# EAGLE design Tiny 5 Circle SMD -v3 (EAGLE 6.2)
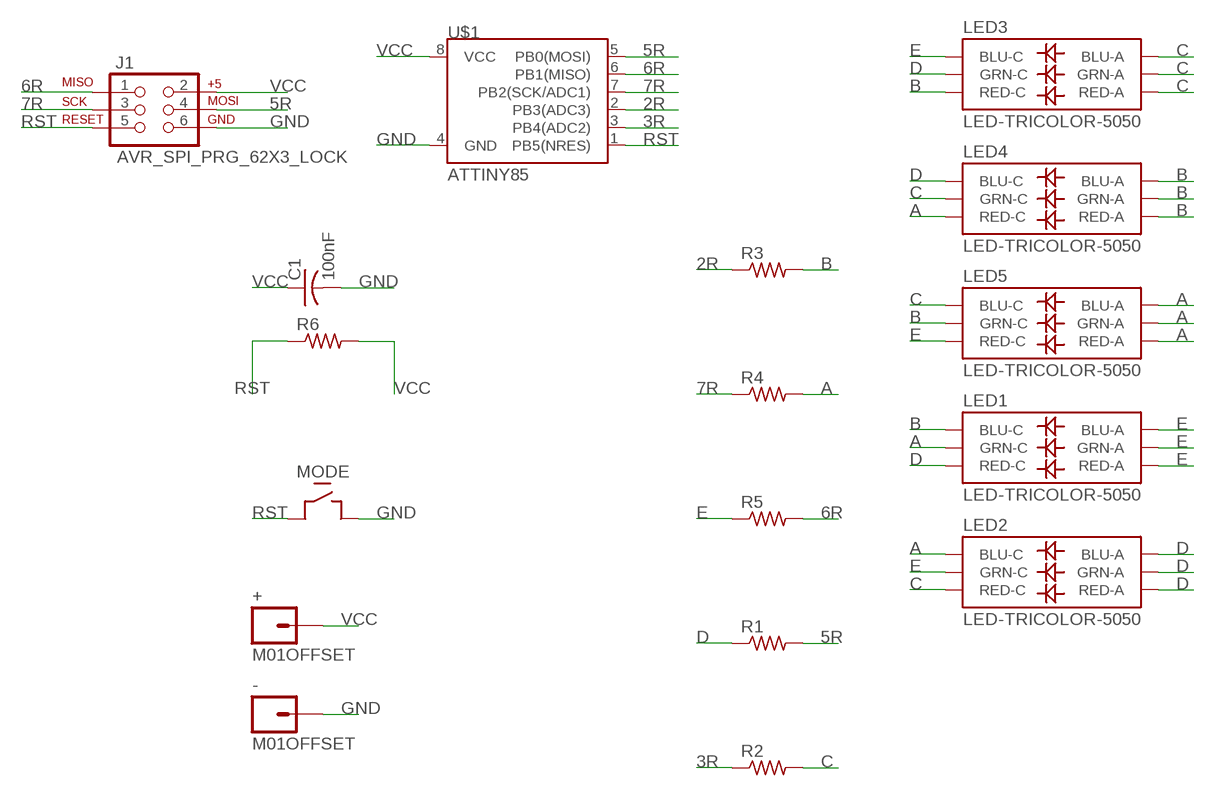
[diagram p0: schematic, sheet 1]

## Parts
+  M01OFFSET  [1X01_OFFSET]
-  M01OFFSET  [1X01_OFFSET]
C1  100nF  C-US025-025X050  [C025-025X050]
J1  AVR_SPI_PRG_62X3_LOCK  [2X3_LOCK]
LED1  LED-TRICOLOR-5050  [LED-TRICOLOR-5050]
LED2  LED-TRICOLOR-5050  [LED-TRICOLOR-5050]
LED3  LED-TRICOLOR-5050  [LED-TRICOLOR-5050]
LED4  LED-TRICOLOR-5050  [LED-TRICOLOR-5050]
LED5  LED-TRICOLOR-5050  [LED-TRICOLOR-5050]
MODE  3X6MM_SWITCH  [6X3MM-TACT]
R1  R-US_M0805  [M0805]
R2  R-US_M0805  [M0805]
R3  R-US_M0805  [M0805]
R4  R-US_M0805  [M0805]
R5  R-US_M0805  [M0805]
R6  R-US_M0805  [M0805]
U$1  ATTINY85  ATTINY45  [SO08-EIAJ]

## Nets
2R: R3.1 U$1.2(PB3(ADC3))
3R: R2.1 U$1.3(PB4(ADC2))
5R: J1.4 R1.2 U$1.5(PB0(MOSI))
6R: J1.1 R5.2 U$1.6(PB1(MISO))
7R: J1.3 R4.1 U$1.7(PB2(SCK/ADC1))
A: LED1.4(GRN-C) LED2.6(BLU-C) LED4.5(RED-C) LED5.1(BLU-A) LED5.2(RED-A) LED5.3(GRN-A) R4.2
B: LED1.6(BLU-C) LED3.5(RED-C) LED4.1(BLU-A) LED4.2(RED-A) LED4.3(GRN-A) LED5.4(GRN-C) R3.2
C: LED2.5(RED-C) LED3.1(BLU-A) LED3.2(RED-A) LED3.3(GRN-A) LED4.4(GRN-C) LED5.6(BLU-C) R2.2
D: LED1.5(RED-C) LED2.1(BLU-A) LED2.2(RED-A) LED2.3(GRN-A) LED3.4(GRN-C) LED4.6(BLU-C) R1.1
E: LED1.1(BLU-A) LED1.2(RED-A) LED1.3(GRN-A) LED2.4(GRN-C) LED3.6(BLU-C) LED5.5(RED-C) R5.1
GND: -.1 C1.2 J1.6 MODE.P$2(OUT) U$1.4(GND)
RST: J1.5 MODE.P$1(IN) R6.1 U$1.1(PB5(NRES))
VCC: +.1 C1.1 J1.2 R6.2 U$1.8(VCC)

## Library data of the parts
+ - = SparkFun:M01: Header 1 Standard 1-pin 0.1" header. Use with straight break away headers (SKU : PRT-00116), right angle break away headers (PRT-00553), swiss pins (PRT-00743), machine pins (PRT-00117), and female headers (PRT-00115).
C1 = adafruit:C-US: CAPACITOR, American symbol
J1 = SparkFun-Connectors:AVR_SPI_PRG_6: AVR ISP 6 Pin This is the reduced ISP connector for AVR programming. Common on Arduino. This footprint will take up less PCB space and can be used with a 10-pin to 6-pin adapter such as SKU: BOB-08508
LED1-LED5 = SparkFun:LED-TRICOLOR-5050
MODE = 00_PERSONAL:3X6MM_SWITCH
R1-R6 = adafruit:R-US_: RESISTOR, American symbol
U$1 = SparkFun:ATTINY45: Atmel ATTiny45

## Board
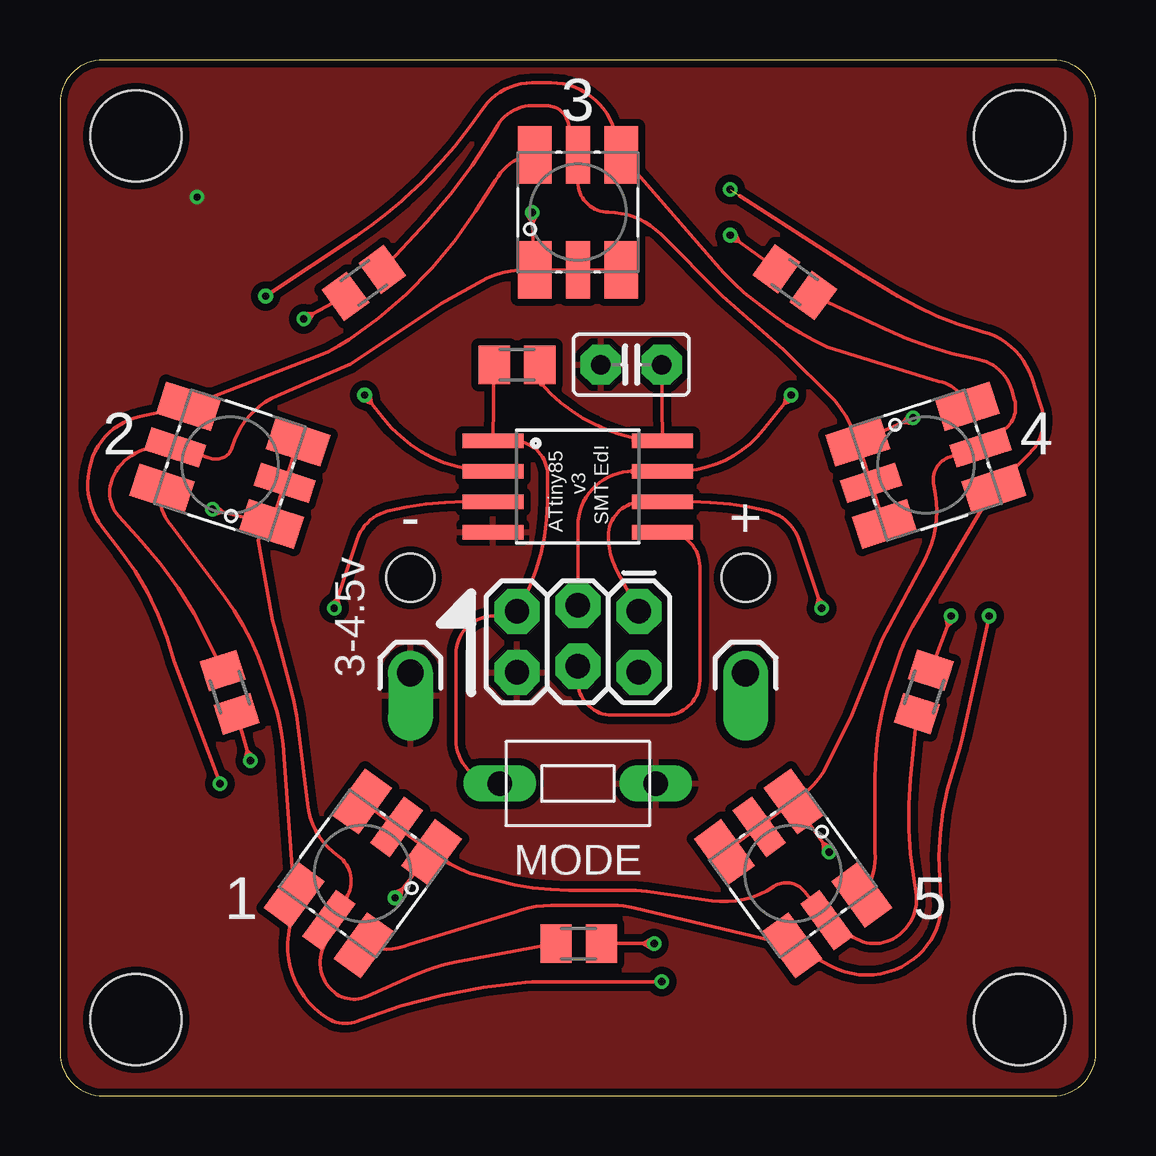
[diagram p1: board, top side]
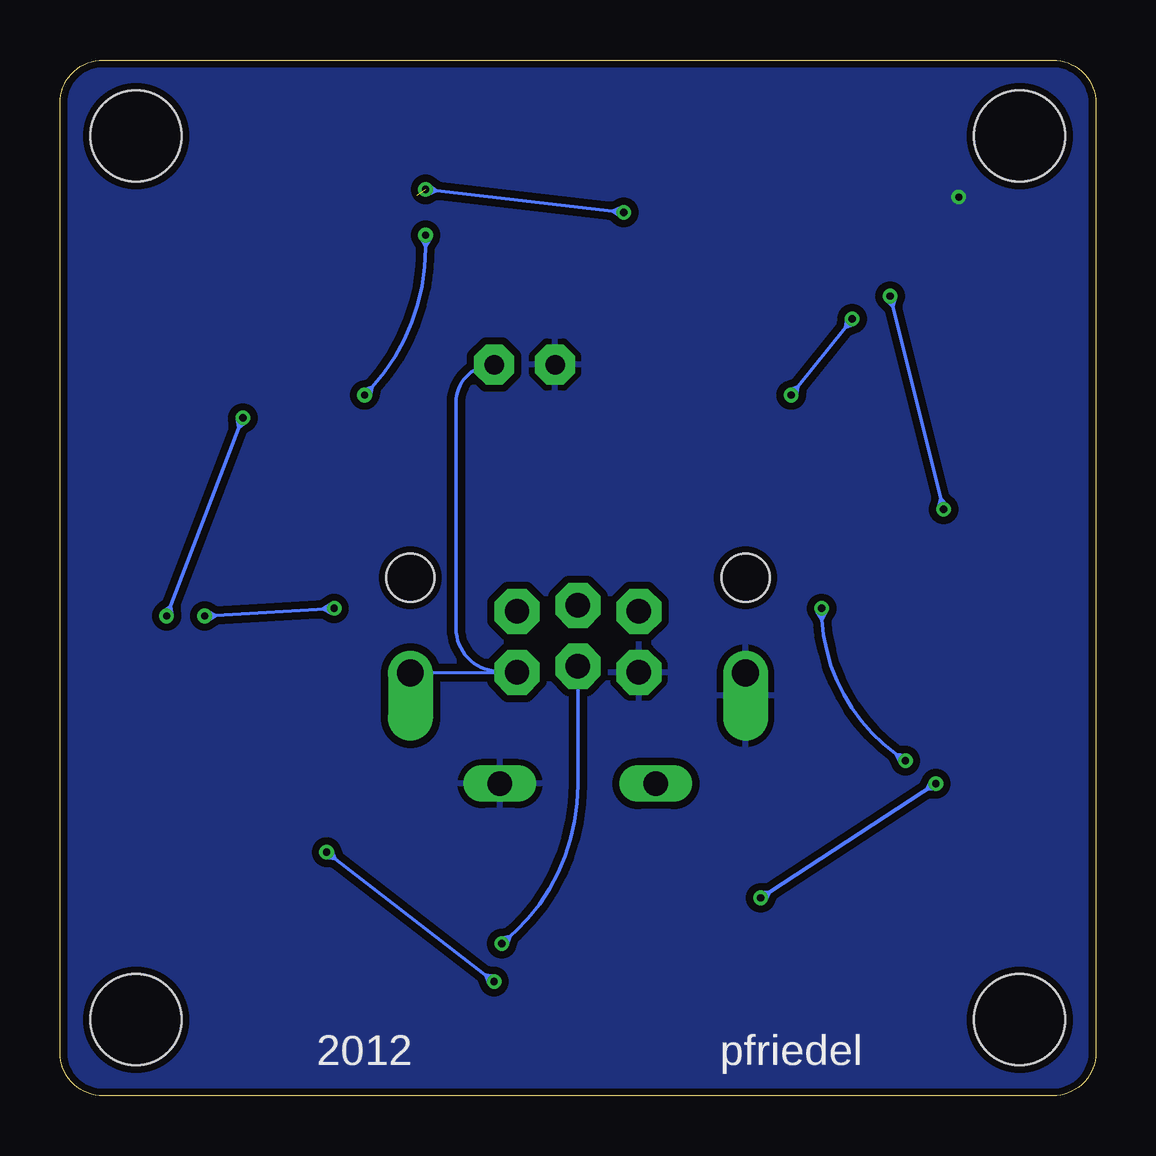
[diagram p2: board, bottom side, seen from below]

Size 43.18 x 43.18 mm. Coordinates in mm from the lower left corner, seen from the top.
Outline: 0,41.38 0,1.8 arc90 1.8,0 41.38,0 arc90 43.18,1.8 43.18,41.38 arc90 41.38,43.18 1.8,43.18 arc90 0,41.38
Copper layers (1*16): Top 0.035mm / dielectric 1.5mm / Bottom 0.035mm
Design rules: minimum track width 6mil, minimum drill 12mil, track to track 6mil, track to pad 6mil, pad to pad 6mil, via to via 6mil, smd to smd 0mil, copper to edge 10mil, drill to drill 10mil, minimum pad ring 10mil, minimum via ring 6mil, stop-mask expansion 2mil, vias tented up to drill 100mil, thermal gap 10mil
Holes 2 mm at 14.61,21.59 28.57,21.59
Holes 3.8 mm at 3.17,40.01 40.01,40.01 3.17,3.17 40.01,3.17

### Footprints (pad centres in the part's own frame; a part is rotated, then mirrored left to right if it is on the bottom)
1X01_OFFSET = drill 1.118 pad 1.88 offset: 1 0,0
C025-025X050 = drill 0.813 pad 1.676 octagon: 1 -1.27,0; 2 1.27,0
2X3_LOCK = drill 1.016 pad 1.88 octagon: 1 0,0; 2 0,2.54; 3 2.54,-0.254; 4 2.54,2.286; 5 5.08,0; 6 5.08,2.54
LED-TRICOLOR-5050 = smd 2.4 x 1.4: 1 -2.4,1.8; 3 -2.4,-1.8; 4 2.4,-1.8; 6 2.4,1.8 | smd 2.4 x 1: 2 -2.4,0; 5 2.4,0
6X3MM-TACT = drill 1.016 long: P$1 -3.251,0; P$2 3.251,0
M0805 = smd 1.3 x 1.6: 1 -0.95,0; 2 0.95,0
SO08-EIAJ = smd 0.61 x 2.54: 1 -1.905,-3.543; 2 -0.635,-3.543; 3 0.635,-3.543; 4 1.905,-3.543; 5 1.905,3.518; 6 0.635,3.518; 7 -0.635,3.518; 8 -1.905,3.518

### Placement (x,y rotation side)
+  28.57,17.62 180 top
-  14.61,17.62 180 top
C1  23.81,30.48 180 top
J1  24.13,20.19 180 top
LED1  12.62,9.27 234 top
LED2  7.09,26.29 162 top
LED3  21.59,36.83 90 top
LED4  36.09,26.29 18 top
LED5  30.56,9.27 306 top
MODE  21.59,13.02 0 top
R1  21.62,6.35 0 top
R2  7.08,16.82 108 top
R3  12.67,33.89 36 top
R4  30.63,33.92 324 top
R5  36.01,16.84 72 top
R6  19.05,30.48 0 top
U$1  21.59,25.4 270 top

### Tracks (layer width: path | path; a pad name or v marks a point on that pad's centre or on a via)
2R  (via drill 0.3)
  Top 0.152: U$1.2 arc-51 13.49,28.23 12.99,28.85 | 12.99,28.85 | 12.99,28.85 v12.7,29.21 | v10.16,32.38 10.56,32.6 | 10.56,32.6 R3.1 | 12.99,28.85 12.93,29.24 | 12.99,28.85 | 12.99,28.85 12.62,29 | v12.7,29.21 12.62,29 | 12.99,28.85 12.93,29.24 | 12.93,29.24 | v12.7,29.21 12.93,29.24 | 12.99,28.85 12.62,29 | 12.99,28.85 12.93,29.24 | v12.7,29.21 12.93,29.24 | 12.99,28.85 12.62,29 | v12.7,29.21 12.62,29 | 10.56,32.6 | 10.56,32.6 10.17,32.61 | 10.56,32.6 10.17,32.61 | v10.16,32.38 10.17,32.61 | 10.56,32.6 10.36,32.27 | v10.16,32.38 10.36,32.27 | 10.56,32.6 10.17,32.61 | v10.16,32.38 10.17,32.61 | 10.56,32.6 10.36,32.27 | v10.16,32.38 10.36,32.27
  Bottom 0.152: v12.7,29.21 12.41,29.57 | 12.41,29.57 | 12.41,29.57 10.45,32.03 | 10.45,32.03 | 10.45,32.03 v10.16,32.38 | 12.41,29.57 | 12.41,29.57 12.78,29.42 | v12.7,29.21 12.78,29.42 | 12.41,29.57 12.47,29.18 | 12.47,29.18 | v12.7,29.21 12.47,29.18 | 12.41,29.57 | 12.41,29.57 12.47,29.18 | v12.7,29.21 12.47,29.18 | 12.41,29.57 12.78,29.42 | v12.7,29.21 12.78,29.42 | 10.45,32.03 10.39,32.42 | 10.45,32.03 | 10.45,32.03 10.08,32.17 | v10.16,32.38 10.08,32.17 | 10.45,32.03 10.39,32.42 | 10.39,32.42 | v10.16,32.38 10.39,32.42 | 10.45,32.03 10.08,32.17 | 10.45,32.03 10.39,32.42 | v10.16,32.38 10.39,32.42 | 10.45,32.03 10.08,32.17 | v10.16,32.38 10.08,32.17
3R  (via drill 0.3)
  Top 0.152: U$1.3 16.87,24.77 arc14 13.66,24.37 arc58 12.39,23.2 v11.43,20.32 | v7.94,13.97 7.81,14.41 | 7.81,14.41 R2.1 | 11.57,20.75 11.28,20.49 | v11.43,20.32 11.28,20.49 | 11.57,20.75 11.65,20.37 | 11.65,20.37 | 11.57,20.75 11.28,20.49 | v11.43,20.32 11.28,20.49 | 11.57,20.75 11.65,20.37 | v11.43,20.32 11.65,20.37 | 7.81,14.41 7.71,14.02 v7.94,13.97 | 7.81,14.41 8.1,14.13 v7.94,13.97
  Bottom 0.152: v11.43,20.32 arc-4 11.42,19.86 | 11.42,19.86 arc-50 8.35,14.27 8.31,14.24 | 8.31,14.24 v7.94,13.97 | 11.42,19.86 | 11.42,19.86 11.62,20.2 | 11.62,20.2 | 11.42,19.86 11.23,20.21 | 8.31,14.24 7.91,14.2 | 7.91,14.2 | 11.42,19.86 | 11.42,19.86 11.62,20.2 | v11.43,20.32 11.62,20.2 | 11.42,19.86 11.23,20.21 | v11.43,20.32 11.23,20.21 | 11.42,19.86 11.62,20.2 | 11.62,20.2 | v11.43,20.32 11.62,20.2 | 11.42,19.86 11.23,20.21 | v11.43,20.32 11.23,20.21 | 11.42,19.86 11.62,20.2 | v11.43,20.32 11.62,20.2 | 11.42,19.86 11.23,20.21 | v11.43,20.32 11.23,20.21 | 8.31,14.24 7.91,14.2 | v7.94,13.97 7.91,14.2 | 8.31,14.24 8.15,13.88 v7.94,13.97
5R  (via drill 0.3)
  Top 0.152: R1.2 24.31,6.35 | 24.31,6.35 v24.77,6.35 | 25.25,23.5 arc-90 26.67,22.07 26.67,17.3 arc-90 25.25,15.88 23.01,15.88 arc-90 21.59,17.3 J1.4 | 24.31,6.35 | 24.31,6.35 | 24.31,6.35 24.65,6.55 | 24.31,6.35 24.65,6.15 | 24.65,6.15 | v24.77,6.35 24.65,6.15 | 24.31,6.35 24.65,6.55 | v24.77,6.35 24.65,6.55 | 24.31,6.35 24.65,6.15 | v24.77,6.35 24.65,6.15 | 24.31,6.35 24.65,6.55 | v24.77,6.35 24.65,6.55
  Top 0.254: U$1.5 25.25,23.5
  Bottom 0.152: v24.77,6.35 arc-51 21.59,12.96 J1.4 | 24.42,6.64 24.55,6.27 | v24.77,6.35 24.55,6.27 | 24.42,6.64 24.8,6.58 | v24.77,6.35 24.8,6.58 | 24.42,6.64 24.55,6.27 | 24.55,6.27 | v24.77,6.35 24.55,6.27 | 24.42,6.64 24.8,6.58 | v24.77,6.35 24.8,6.58 | 24.42,6.64 24.55,6.27 | v24.77,6.35 24.55,6.27 | 24.42,6.64 24.81,6.58 v24.77,6.35
6R  (via drill 0.3)
  Top 0.152: R5.2 36.99,19.57 | 36.99,19.57 v37.15,20 | v31.75,20.32 31.61,20.75 | 31.61,20.75 30.79,23.2 arc58 29.52,24.37 arc14 26.31,24.77 U$1.6 | 24.28,24.77 arc90 22.86,23.34 arc28 23.24,21.84 J1.1 | 36.99,19.57 37.29,19.83 v37.15,20 | 36.99,19.57 36.92,19.96 v37.15,20 | 31.61,20.75 31.53,20.37 | v31.75,20.32 31.53,20.37 | 31.61,20.75 31.9,20.49 | v31.75,20.32 31.9,20.49 | 31.61,20.75 31.53,20.37 | v31.75,20.32 31.53,20.37 | 31.61,20.75 31.9,20.49 | v31.75,20.32 31.9,20.49
  Top 0.254: U$1.6 24.28,24.77
  Bottom 0.152: v37.15,20 36.98,20 | v31.75,20.32 36.69,20.03 | 36.69,20.03 v37.15,20 | 36.69,20.03 37.05,20.21 | 37.05,20.21 | 36.69,20.03 37.02,19.81 v37.15,20 | 36.69,20.03 37.05,20.21 | v37.15,20 37.05,20.21 | 32.21,20.29 31.85,20.12 | v31.75,20.32 31.85,20.12 | 32.21,20.29 31.88,20.51 v31.75,20.32 | 32.21,20.29 31.85,20.12 | v31.75,20.32 31.85,20.12
7R  (via drill 0.3)
  Top 0.152: R4.1 28.31,35.61 | 28.31,35.61 | 28.31,35.61 v27.94,35.88 | v30.48,29.21 30.19,28.85 | 30.19,28.85 29.33,27.77 arc-51 25.72,26.04 24.45,26.04 | 23.88,26.04 arc90 21.59,23.75 J1.3 | 28.15,35.97 | 28.15,35.97 | 28.31,35.61 28.15,35.97 | v27.94,35.88 28.15,35.97 | 28.31,35.61 | 28.31,35.61 27.92,35.65 | v27.94,35.88 27.92,35.65 | 28.31,35.61 28.15,35.97 | 28.31,35.61 27.92,35.65 | 28.31,35.61 28.15,35.97 | v27.94,35.88 28.15,35.97 | 28.31,35.61 27.92,35.65 | v27.94,35.88 27.92,35.65 | 30.19,28.85 | 30.19,28.85 30.56,29 | v30.48,29.21 30.56,29 | 30.19,28.85 | 30.19,28.85 30.25,29.24 | 30.19,28.85 30.56,29 | 30.19,28.85 30.25,29.24 | v30.48,29.21 30.25,29.24 | 30.19,28.85 30.56,29 | v30.48,29.21 30.56,29 | 30.19,28.85 30.25,29.24 | v30.48,29.21 30.25,29.24
  Top 0.254: U$1.7 24.45,26.04 23.88,26.04
  Bottom 0.152: v30.48,29.21 arc-3 30.16,29.54 | 30.16,29.54 arc-42 27.94,35.34 27.94,35.42 | 27.94,35.42 v27.94,35.88 | 30.16,29.54 30.26,29.16 | 30.16,29.54 30.55,29.43 | 30.55,29.43 | v30.48,29.21 30.55,29.43 | 27.94,35.42 | 27.94,35.42 | 27.94,35.42 27.74,35.76 | 27.94,35.42 28.14,35.76 | 28.14,35.76 | v27.94,35.88 28.14,35.76 | 27.94,35.42 27.74,35.76 | v27.94,35.88 27.74,35.76 | 27.94,35.42 28.14,35.76 | v27.94,35.88 28.14,35.76 | 27.94,35.42 27.74,35.76 | v27.94,35.88 27.74,35.76 | 30.16,29.54 | 30.16,29.54 30.26,29.16 | v30.48,29.21 30.26,29.16 | 30.16,29.54 | 30.16,29.54 30.55,29.43 | v30.48,29.21 30.55,29.43 | 30.16,29.54 30.26,29.16 | 30.26,29.16 | v30.48,29.21 30.26,29.16 | 30.16,29.54 30.55,29.43 | v30.48,29.21 30.55,29.43 | 30.16,29.54 30.26,29.16 | v30.48,29.21 30.26,29.16 | 30.16,29.54 30.55,29.43 | v30.48,29.21 30.55,29.43
A  (via drill 0.3)
  Top 0.152: LED2.6 arc58 4.65,23.75 6.84,20.83 arc-18 8.52,17.63 8.92,16.43 arc-13 9.29,14.64 LED1.4 9.53,6.72 arc66 11.16,3.23 arc53 12.39,3.11 12.56,3.17 arc-16 19.41,4.74 19.68,4.76 v25.08,4.76 | 37.1,26.63 LED4.5 39.38,27.79 arc69 39.79,29.01 39.67,29.43 arc63 38.3,30.7 38.14,30.73 arc-14 34.4,31.96 R4.2 | 37.1,26.63 arc87 36.42,25.43 arc-42 36.05,22.34 34.29,19.05 33.02,15.88 31.85,13.53 arc-24 LED5.1 | 37.1,26.63 38.24,27.07 | LED5.1 31.81,10.54 | 31.81,10.54 v32.07,10.16 | LED5.1 LED5.2 LED5.3 | 31.81,10.54 31.84,10.14 v32.07,10.16 | 31.81,10.54 32.16,10.37 v32.07,10.16
  Bottom 0.152: v32.07,10.16 31.71,9.88 | 31.71,9.88 v25.08,4.76 | 31.71,9.88 32.1,9.93 v32.07,10.16 | 31.71,9.88 31.86,10.25 v32.07,10.16 | v25.08,4.76 25.05,4.99 25.44,5.04 25.29,4.68 v25.08,4.76
B  (via drill 0.3)
  Top 0.152: LED4.1 arc21 32.29,28.98 30.16,31.11 27.62,33.34 25.03,35.93 arc45 22.86,36.83 arc-90 21.59,38.1 LED3.5 21.15,40.64 arc73 20.29,41.27 19.7,41.27 arc59 18.23,40.45 17.99,40.03 arc-12 15.29,36.45 R3.2 | LED5.4 23.93,7.84 arc12 23.05,7.94 20.47,7.94 arc21 18.95,7.65 14.56,6.31 arc-42 LED1.6 | LED4.1 LED4.2 LED4.3 | LED5.4 30.77,5.99 | v35.56,28.26 LED4.1 | 35.14,28.07 35.54,28.03 | v35.56,28.26 35.54,28.03 | 35.14,28.07 35.38,28.39 | 35.14,28.07 35.54,28.03 | 35.54,28.03 | v35.56,28.26 35.54,28.03 | 35.14,28.07 35.38,28.39 | v35.56,28.26 35.38,28.39 | 35.14,28.07 35.54,28.03 | v35.56,28.26 35.54,28.03 | 35.14,28.07 35.38,28.39 | v35.56,28.26 35.38,28.39 | LED5.4 32.15,5.41 arc66 35.6,5.71 arc56 36.73,8.22 36.67,9.07 arc-22 37.26,13.67 arc6 37.61,14.92 v38.73,20
  Bottom 0.152: v35.56,28.26 35.72,27.83 | 35.72,27.83 v38.73,20 | 35.79,28.22 | v35.56,28.26 35.79,28.22 | 35.72,27.83 35.79,28.22 | v35.56,28.26 35.79,28.22 | 35.72,27.83 35.42,28.08 v35.56,28.26 | 38.57,20.43 38.88,20.18 | 38.57,20.43 38.51,20.04 | 38.51,20.04 | v38.73,20 38.51,20.04 | 38.57,20.43 38.88,20.18 | v38.73,20 38.88,20.18 | 38.57,20.43 38.51,20.04 | v38.73,20 38.51,20.04 | 38.57,20.43 38.88,20.18 | v38.73,20 38.88,20.18
C  (via drill 0.3)  (1 unrouted)
  Top 0.152: LED3.1 arc28 17.81,34.09 15.88,33.02 12.11,30.51 arc-10 12.01,30.46 9.08,29.2 arc51 7.18,27.05 arc-91 6.29,26.57 | LED4.4 35.53,19.56 arc9 35.04,18.5 34.75,17.7 arc20 33.97,13.28 33.97,10.14 arc-45 LED5.6 33.34,9.21 | LED3.1 LED3.2 LED3.3 | 39.27,25.44 LED4.4 | 6.29,26.57 LED2.5 4.04,27.02 arc73 2.13,25.54 arc58 2.45,24.17 3.39,23.13 arc-17 6.17,19.01 R2.2 | v19.68,36.83 LED3.1 | 6.29,26.57 5.38,26.88 | 19.71,36.37 19.89,36.73 | 19.89,36.73 | 19.71,36.37 19.89,36.73 | v19.68,36.83 19.89,36.73 | 19.71,36.37 19.49,36.71 v19.68,36.83 | 28.32,37.53 33.34,34.29 34.93,33.34 arc16 38.3,31.9 38.49,31.84 arc-56 40.5,29.95 40.89,28.77 arc-64 40.42,26.78 LED4.4
  Bottom 0.152: v19.68,36.83 20.14,36.88 | 20.14,36.88 27.49,37.73 | 27.49,37.73 v27.94,37.78 | 20.14,36.88 19.78,37.04 v19.68,36.83 | 20.14,36.88 19.82,36.65 v19.68,36.83 | 27.49,37.73 27.85,37.57 v27.94,37.78 | 27.49,37.73 27.8,37.97 v27.94,37.78
D  (via drill 0.3)
  Top 0.152: LED2.1 8.26,23.18 8.83,20.02 arc5 8.98,19.36 9.58,17.15 arc-9 9.96,15.21 10.31,12.18 arc48 11.61,9.99 arc-93 11.87,8.16 | 11.87,8.16 LED1.5 | LED3.4 27.66,34.31 arc11 28.97,33.12 29.76,32.53 arc13 31.98,31.22 36.64,29.78 arc-62 LED4.6 | LED2.3 LED2.2 LED2.1 | LED3.4 23.4,39.17 | 11.87,8.16 11.08,7.18 | LED2.1 v6.35,24.45 | v6.35,24.45 6.51,24.61 6.79,24.34 6.42,24.23 v6.35,24.45 | v8.57,33.34 12.34,35.85 arc7 14.24,37.3 14.35,37.4 arc13 17.07,40.37 17.67,41.21 arc-54 19.68,42.23 20.48,42.23 arc-74 23.11,40.24 LED3.4 | 11.87,8.16 10.98,6.2 arc76 11.44,4.31 arc63 12.79,4.14 14.66,4.99 arc-14 16.53,5.58 R1.1
  Bottom 0.152: v6.35,24.45 6.46,24.89 | 6.46,24.89 8.46,32.89 | 8.46,32.89 v8.57,33.34 | 6.46,24.89 6.19,24.61 v6.35,24.45 | 6.46,24.89 6.57,24.51 v6.35,24.45 | 8.46,32.89 8.74,33.18 v8.57,33.34 | 8.46,32.89 8.35,33.27 v8.57,33.34
E  (via drill 0.3)
  Top 0.152: LED3.6 arc58 18.16,38.16 17.32,36.87 arc-23 12.05,31.53 arc-11 10.74,30.83 LED2.4 3.33,28.31 arc67 1.24,26.19 1.21,26.07 arc49 1.76,23.71 2.53,22.71 arc-24 4.76,18.1 v6.67,13.02 | 31.02,8.52 LED5.5 33.08,6.61 arc67 34.86,6.62 arc66 35.68,8.51 35.59,9.06 arc-15 35.45,13.19 R5.1 | 31.02,8.52 arc85 29.75,8.72 arc-42 27.17,8.14 24.46,8.53 arc8 23.79,8.57 21.21,8.57 arc-15 18.21,8.97 17.1,9.28 arc-14 LED1.1 | 31.02,8.52 32.06,7.23 | LED1.1 v13.97,8.26 | v13.97,8.26 13.89,8.47 14.26,8.61 14.2,8.22 v13.97,8.26 | LED1.3 LED1.2 LED1.1
  Bottom 0.152: v13.97,8.26 13.59,8.51 | 13.59,8.51 v6.67,13.02 | 13.59,8.51 13.77,8.15 v13.97,8.26 | 13.59,8.51 13.98,8.48 v13.97,8.26 | v6.67,13.02 6.87,13.12 7.05,12.77 6.66,12.79 v6.67,13.02
GND  (via drill 0.3)
  other vias: 5.71,37.47
  pour Top (isolate 0.305): 0,43.18 0,0 43.18,0 43.18,43.18
  pour Bottom (isolate 0.305): 0,43.18 0,0 43.18,0 43.18,43.18
RST
  Top 0.152: R6.1 U$1.1 | 18.9,27.3 arc-90 20.32,25.89 20.32,24.73 arc-28 19.28,20.61 J1.5 | 19.05,20 18.1,20 arc90 16.51,18.41 16.51,14.85 arc90 MODE.P$1
  Top 0.254: U$1.1 18.9,27.3 | J1.5 19.05,20
VCC
  Top 0.152: 20.07,29.69 arc37 23.85,27.44 24.45,27.3 | U$1.8 C1.1
  Top 0.254: R6.2 20.07,29.69 | 23.93,27.3 24.45,27.3 U$1.8
  Bottom 0.152: +.1 J1.2 24.96,17.7 arc87 26.67,19.49 26.67,28.89 arc90 C1.1

### Text on the board
tPlace: 3 | 2 | 4 | v3 | SMT Ed! | ATtiny85 | 3-4.5v | 1 | 5
bPlace: pfriedel | 2012
bStop: \\O_o/